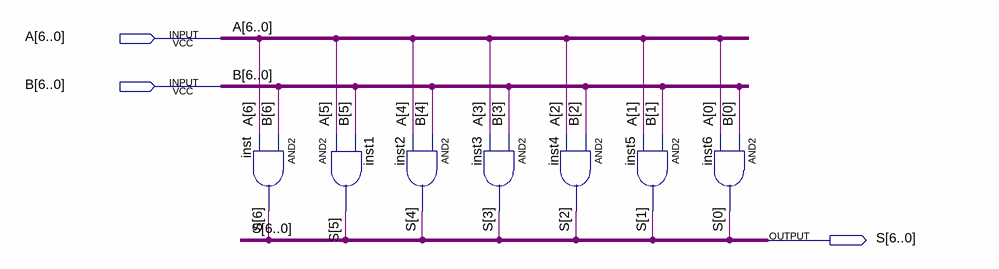
[diagram p0: schematic sheet]
// Quartus schematic And_Bus.bdf as structural Verilog: 7 symbols, 3 pins
module And_Bus (
  input  [6:0] A,
  input  [6:0] B,
  output [6:0] S
);

  and inst (S[6], B[6], A[6]);
  and inst1 (S[5], A[5], B[5]);
  and inst2 (S[4], B[4], A[4]);
  and inst3 (S[3], B[3], A[3]);
  and inst4 (S[2], B[2], A[2]);
  and inst5 (S[1], B[1], A[1]);
  and inst6 (S[0], B[0], A[0]);
endmodule
